# EAGLE schematic vcf-diode-ladder (EAGLE 6.5.0)
VCA
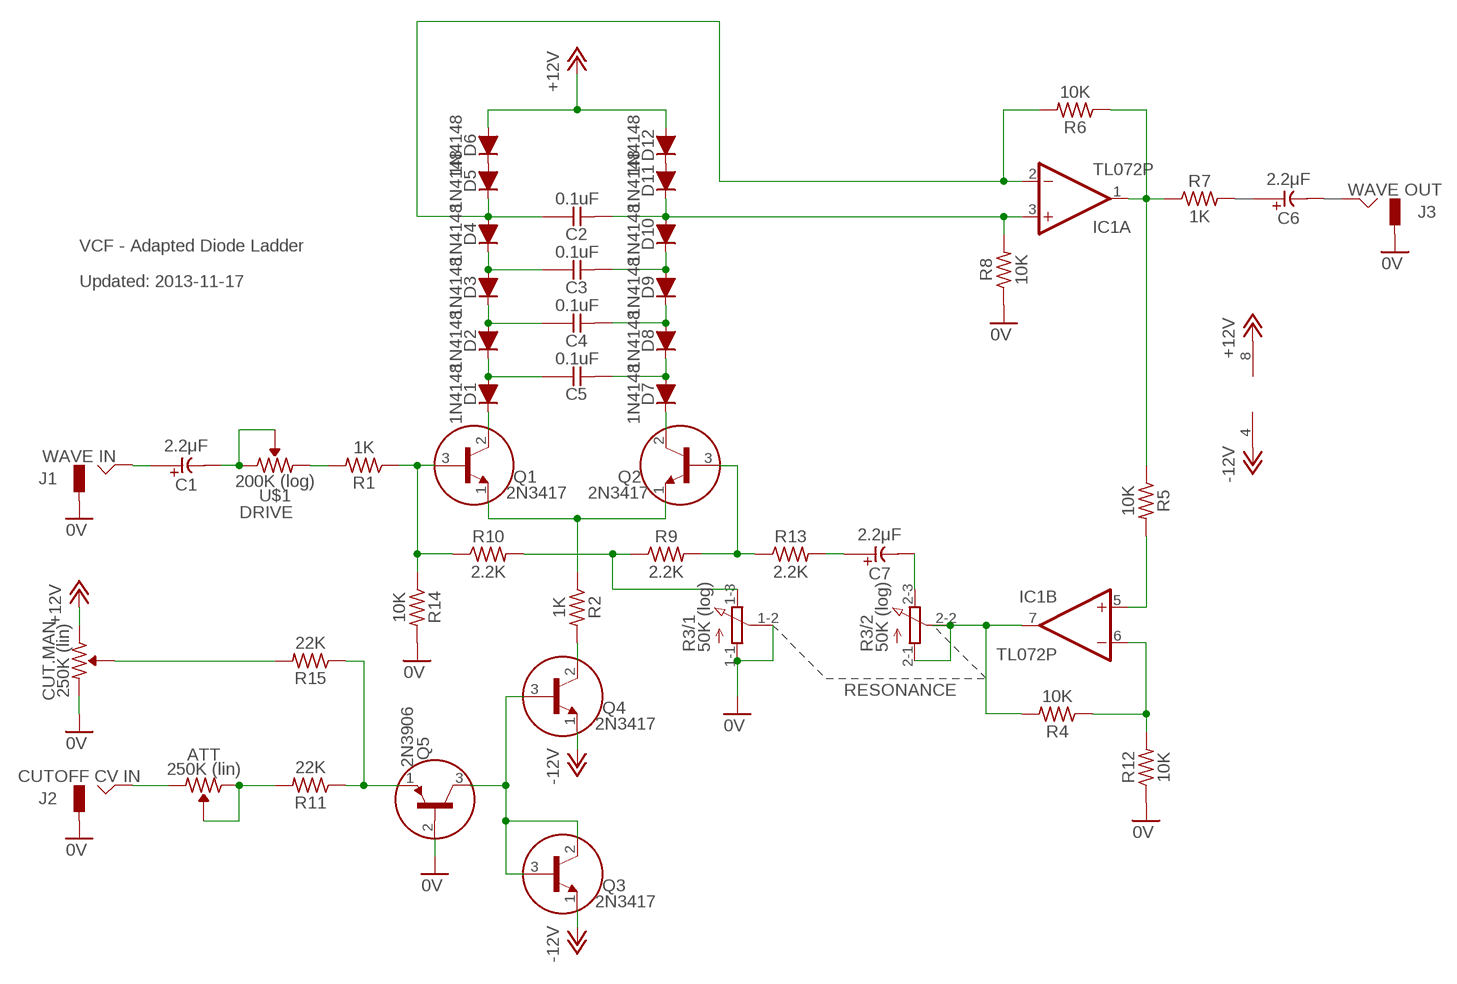
[diagram p0: schematic, sheet 1]

## Parts
ATT  250K (lin)  R-VAR  [R-VAR]
C1  2.2μF  CE-USE2-5  [E2-5]
C2  0.1uF  CC-US025-024X044  [C025-024X044]
C3  0.1uF  CC-US025-024X044  [C025-024X044]
C4  0.1uF  CC-US025-024X044  [C025-024X044]
C5  0.1uF  CC-US025-024X044  [C025-024X044]
C6  2.2μF  CE-USE2-5  [E2-5]
C7  2.2μF  CE-USE2-5  [E2-5]
CUT.MAN  250K (lin)  R-VAR  [R-VAR]
D1  1N4148  [DO35-7]
D2  1N4148  [DO35-7]
D3  1N4148  [DO35-7]
D4  1N4148  [DO35-7]
D5  1N4148  [DO35-7]
D6  1N4148  [DO35-7]
D7  1N4148  [DO35-7]
D8  1N4148  [DO35-7]
D9  1N4148  [DO35-7]
D10  1N4148  [DO35-7]
D11  1N4148  [DO35-7]
D12  1N4148  [DO35-7]
IC1  TL072P  [DIL08]
J1  WAVE IN  JACK-M  [JACK-M]
J2  CUTOFF CV IN  JACK-M  [JACK-M]
J3  WAVE OUT  JACK-M  [JACK-M]
Q1  2N3417  [TO92]
Q2  2N3417  [TO92]
Q3  2N3417  [TO92]
Q4  2N3417  [TO92]
Q5  2N3906  [TO92]
R1  1K  R0309/10  [0309/10]
R2  1K  R0309/10  [0309/10]
R3  50K (log)  3RP/1610G  [3RP/1610G]
R4  10K  R0309/10  [0309/10]
R5  10K  R0309/10  [0309/10]
R6  10K  R0309/10  [0309/10]
R7  1K  R0309/10  [0309/10]
R8  10K  R0309/10  [0309/10]
R9  2.2K  R0309/10  [0309/10]
R10  2.2K  R0309/10  [0309/10]
R11  22K  R0309/10  [0309/10]
R12  10K  R0309/10  [0309/10]
R13  2.2K  R0309/10  [0309/10]
R14  10K  R0309/10  [0309/10]
R15  22K  R0309/10  [0309/10]
U$1  200K (log)  R-VAR  [R-VAR]

## Nets
0V: CUT.MAN.R2 J1.GND J2.GND J3.GND Q5.2(B) R3.1-1(/1:A) R3.1-2(/1:S) R8.1 R12.1 R14.2
+12V: CUT.MAN.R1 D6.A D12.A IC1.8(P:V+)
-12V: IC1.4(P:V-) Q3.1(E) Q4.1(E)
N$1: C1.+ J1.HOT
N$2: C1.- U$1.R1 U$1.VAR
N$3: R1.2 U$1.R2
N$4: ATT.R2 J2.HOT
N$5: Q1.3(B) R1.1 R10.1 R14.1
N$6: CUT.MAN.VAR R15.2
N$7: C7.- R3.2-3(/2:E)
N$8: IC1.6(B:-IN) R4.1 R12.2
N$9: C2.1 D4.A D5.C IC1.2(A:-IN) R6.2
N$10: Q2.3(B) R9.2 R13.1
N$11: Q1.1(E) Q2.1(E) R2.1
N$12: Q5.1(E) R11.1 R15.1
N$13: IC1.1(A:OUT) R5.1 R6.1 R7.1
N$14: R3.1-3(/1:E) R9.1 R10.2
N$15: Q4.2(C) R2.2
N$16: Q3.2(C) Q3.3(B) Q4.3(B) Q5.3(C)
N$17: IC1.7(B:OUT) R3.2-1(/2:A) R3.2-2(/2:S) R4.2
N$18: C7.+ R13.2
N$19: IC1.5(B:+IN) R5.2
N$20: D5.A D6.C
N$21: D11.A D12.C
N$22: C3.1 D3.A D4.C
N$23: C4.1 D2.A D3.C
N$24: C5.1 D1.A D2.C
N$25: C2.2 D10.A D11.C IC1.3(A:+IN) R8.2
N$26: C3.2 D9.A D10.C
N$27: C4.2 D8.A D9.C
N$28: C5.2 D7.A D8.C
N$29: D7.C Q2.2(C)
N$30: D1.C Q1.2(C)
N$31: ATT.R1 ATT.VAR R11.2
Unconnected: C6.+ C6.- J3.HOT R7.2

## Notes on the sheet
- VCF - Adapted Diode Ladder
- Updated: 2013-11-17
- DRIVE
- RESONANCE

## Library data of the parts
ATT CUT.MAN U$1 = _common:R-VAR
C1 C6 C7 = _common:CE-US: ELECTROLYTIC CAPACITOR, US symbol
C2-C5 = _common:CC-US: CAPACITOR, US symbol
D1-D12 = _common:1N4148: DIODE high speed (Philips)
IC1 = _common:TL072: OP AMP
J1-J3 = _common:JACK-M
Q1-Q4 = _common:2N3417: NPN Transistor
Q5 = _common:2N3906: PNP Transistor
R1 R2 R4-R15 = _common:R: RESISTOR, US symbol
R3 = pot:3RP/1610G: 16mm Potentiometer two level Source: http://www.alphapotentiometers.net/html/16mm_pot_2.html